# EAGLE design esp_ble (EAGLE 7.1.0)
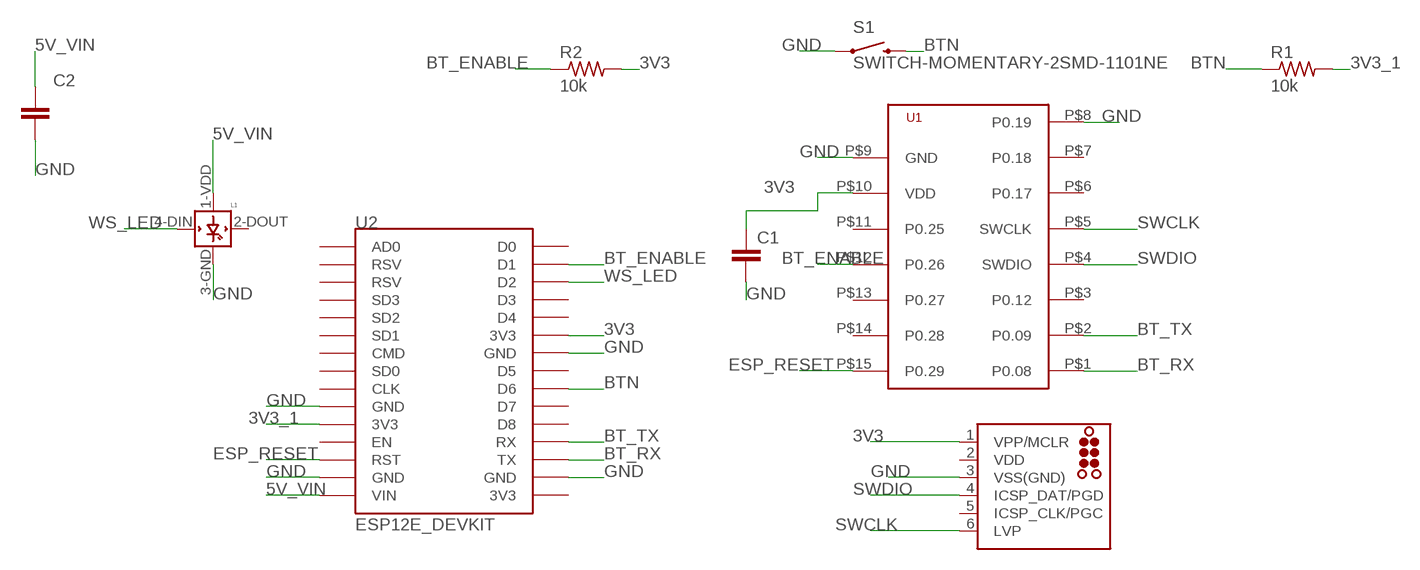
[diagram p0: schematic, sheet 1]

## Parts
C1  CAP0603-CAP  [0603-CAP]
C2  CAPACITOR_NPOL-0603  [C603]
J1  TC2030-MCP-NL  [TC2030-MCP-NL]
L1  WS2812B  [WS2812B]
R1  10k  RESISTOR0603  [R0603]
R2  10k  RESISTOR0603  [R0603]
S1  SWITCH-MOMENTARY-2SMD-1101NE  [TACTILE-SWITCH-1101NE]
U1  PTR5518  [PTR5518]
U2  ESP12E_DEVKIT  [ESP12E_DEVKIT]

## Nets
3V3: C1.1 J1.1(VPP/MCLR) R2.2 U1.P$10(VDD) U2.3V3@1(3V3)
3V3_1: R1.2 U2.3V3@0(3V3)
5V_VIN: C2.1 L1.1-VDD(VDD) U2.VIN
BT_ENABLE: R2.1 U1.P$12(P0.26) U2.D1
BT_RX: U1.P$1(P0.08) U2.TX
BT_TX: U1.P$2(P0.09) U2.RX
BTN: R1.1 S1.2 U2.D6
ESP_RESET: U1.P$15(P0.29) U2.RST
GND: C1.2 C2.2 J1.3(VSS(GND)) L1.3-GND(GND) S1.1 U1.P$8(P0.19) U1.P$9(GND) U2.GND@0(GND) U2.GND@1(GND) U2.GND@2(GND) U2.GND@3(GND)
SWCLK: J1.6(LVP) U1.P$5(SWCLK)
SWDIO: J1.4(ICSP_DAT/PGD) U1.P$4(SWDIO)
WS_LED: L1.4-DIN(DIN) U2.D2
Unconnected: J1.5(ICSP_CLK/PGC) L1.2-DOUT(DOUT) U1.P$3(P0.12) U1.P$6(P0.17) U1.P$7(P0.18) U1.P$11(P0.25) U1.P$13(P0.27) U1.P$14(P0.28) U2.3V3@2(3V3) U2.AD0 U2.CLK U2.CMD U2.D0 U2.D3 U2.D4 U2.D5 U2.D7 U2.D8 U2.EN U2.RSV@0(RSV) U2.RSV@1(RSV) U2.SD0 U2.SD1 U2.SD2 U2.SD3

## Power pins joined to a net without a drawn wire
VDD: J1.2(VDD)

## Library data of the parts
C1 = SparkFun:CAP: Capacitor Standard 0603 ceramic capacitor, and 0.1" leaded capacitor.
C2 = dp_devices:CAPACITOR_NPOL: Non-Polarized capacitor in various packages
J1 = tag-connect:TC2030: TAG-CONNECT ICSP Connector Manufacturer: Tag-Connect <http://www.tag-connect.com> Cable for easy In-Circuit Serial Programming. Designed for Microchip ICD2, suitable for many others. Two variants - one "with legs" (for hands-free fit on PCB) and another "without legs" for quick programming. PAD Description 1 MCLR/Vpp 2 Vdd 3 GND 4 PGD (ISPDAT) 5 PGC (ISPCLK) 6 nc (used for LVP) ©2009 ROFA.cz - modified and updated by Robert Darlington ‹rdarlington@gmail.com›
L1 = adafruit:WS2812B
R1 R2 = CEDT:RESISTOR
S1 = SparkFun-Electromechanical:SWITCH-MOMENTARY-2: Various NO switches- pushbuttons, reed, etc; PROD_ID: SWCH-00815
U1 = lio:PTR5518
U2 = ESP12E_DEVKIT:ESP12E_DEVKIT: ESP12E DEVKIT BOARD

## Board
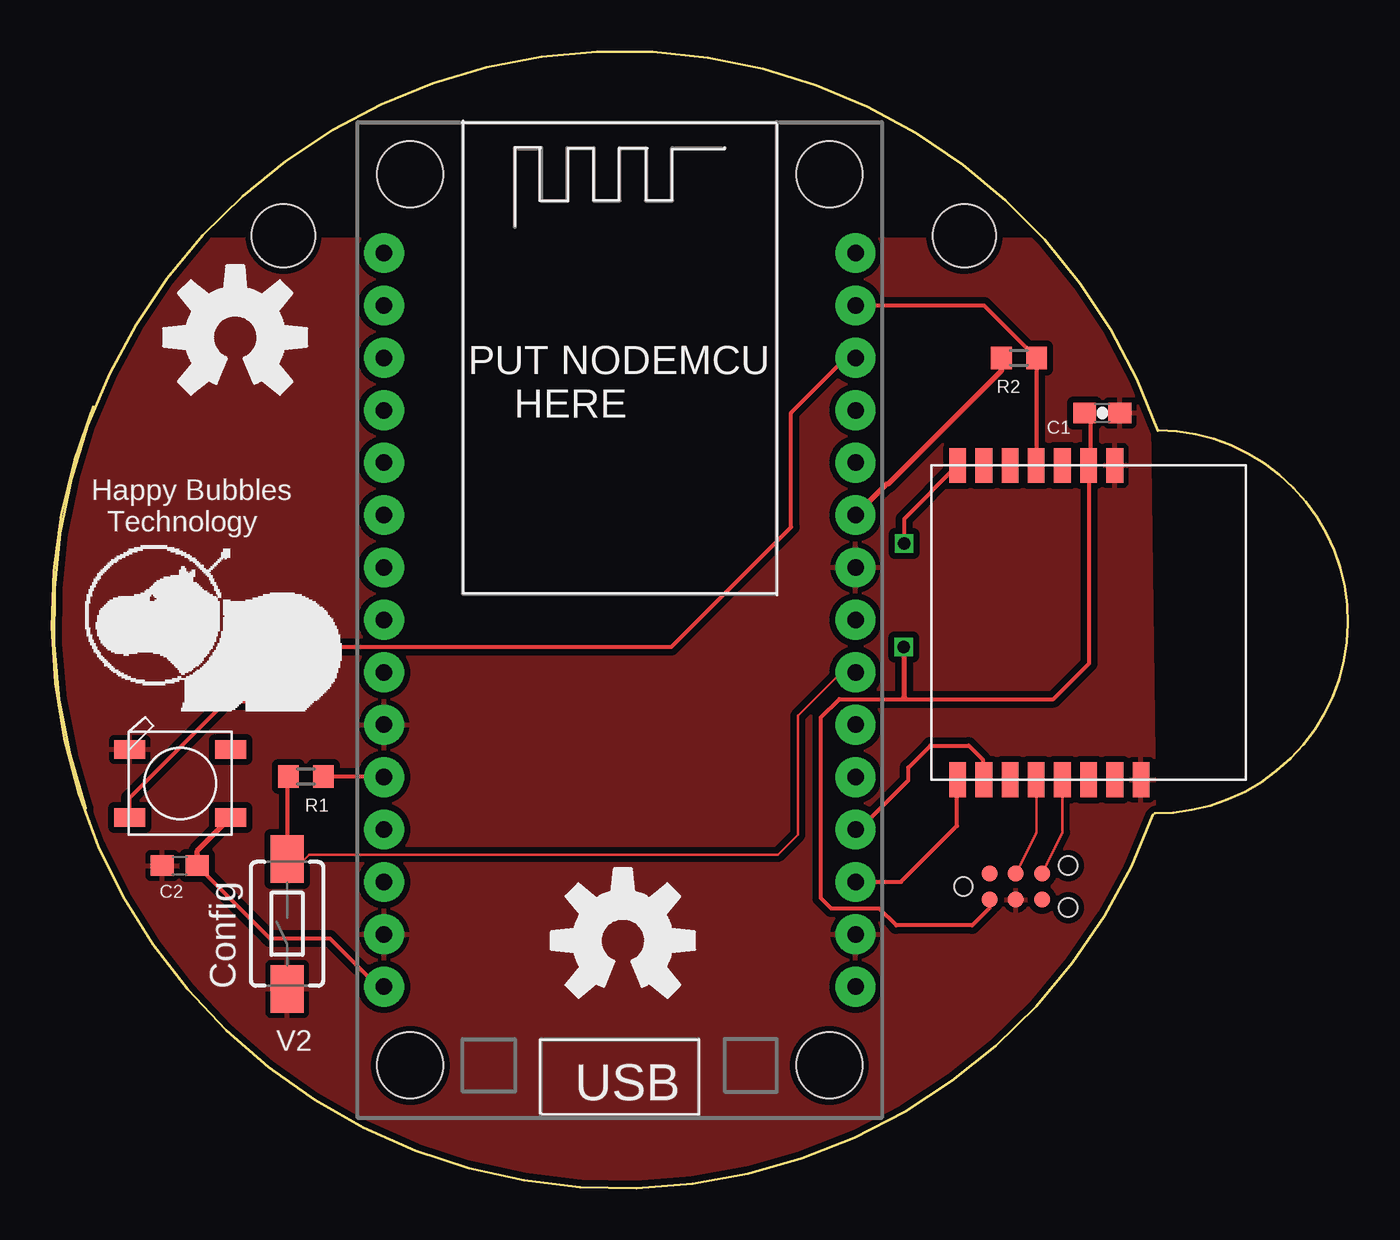
[diagram p1: board, top side]
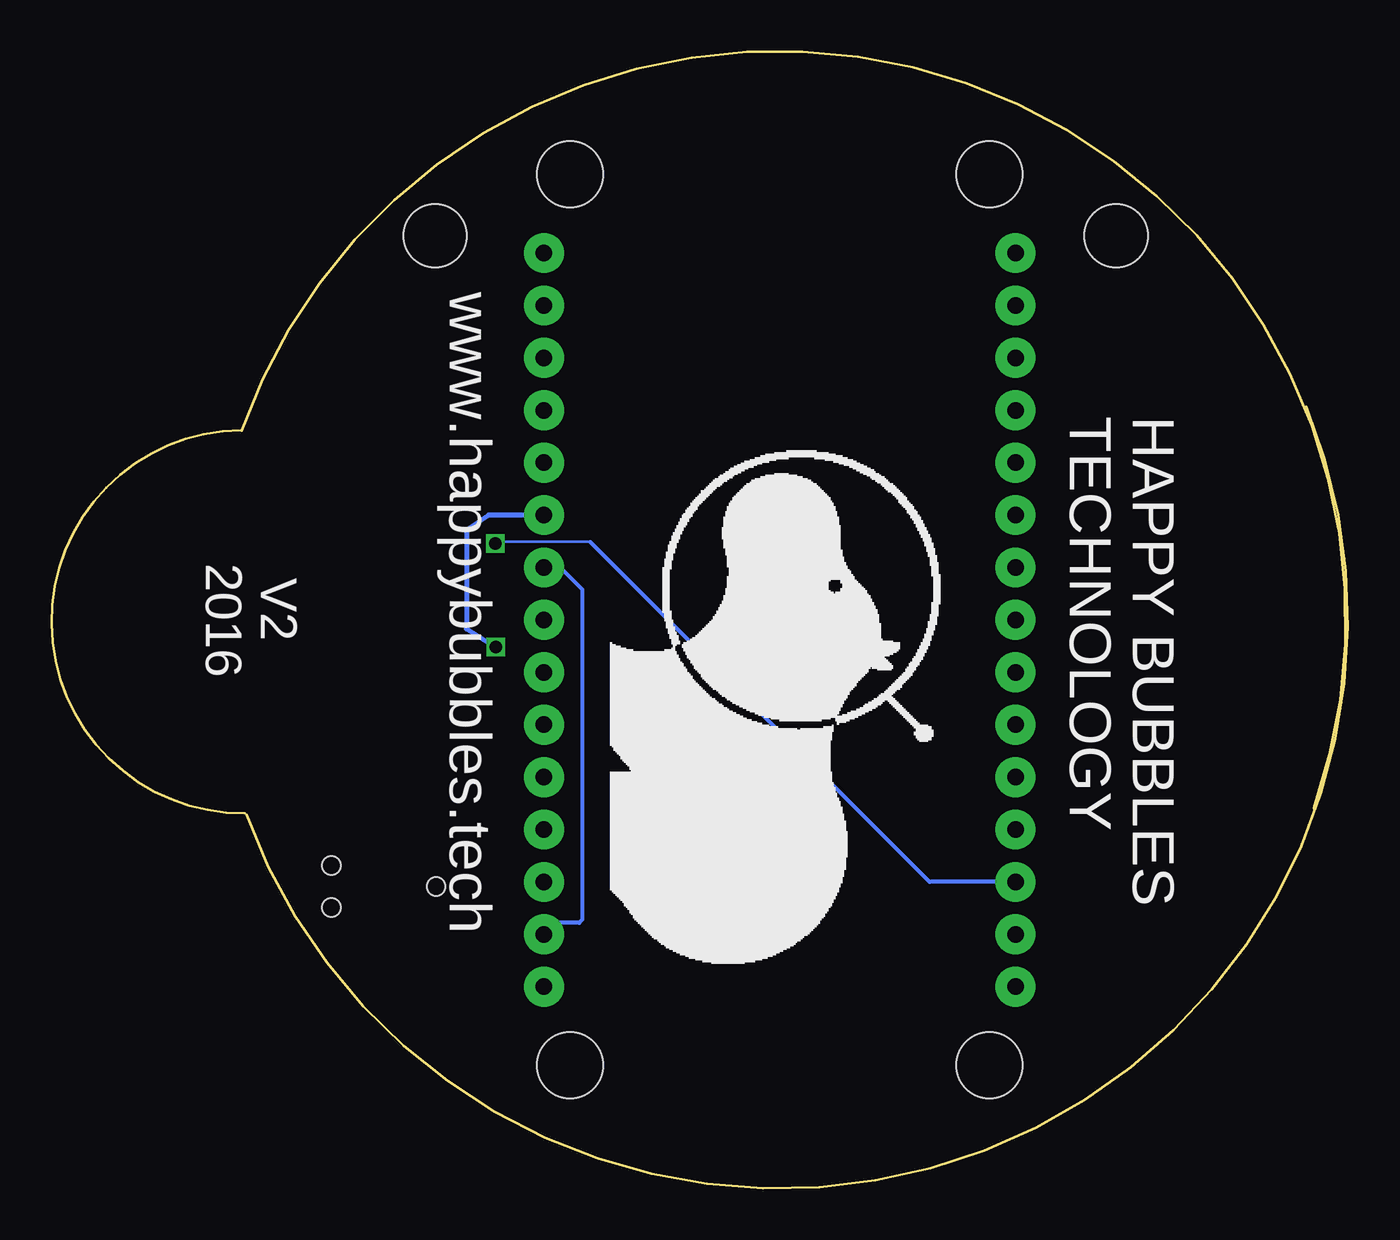
[diagram p2: board, bottom side, seen from below]

Size 62.86 x 55.09 mm. Coordinates in mm from the lower left corner, seen from the top.
Outline: 53.66,36.74 arc-180 53.48,18.17
Outline: 53.64,36.72 arc180 1.67,18.43
Outline: 53.41,18.1 arc-182 2.02,37.89
Copper layers (1*16): Top 0.035mm / dielectric 1.5mm / Bottom 0.035mm
Design rules "dirt_cheap_dirty_boards.v1": minimum track width 5mil, minimum drill 12mil, track to track 5mil, track to pad 5mil, pad to pad 5mil, via to via 5mil, smd to smd 0mil, copper to edge 10mil, drill to drill 10mil, minimum pad ring 10mil, minimum via ring 6mil, stop-mask expansion 2mil, vias tented up to drill 25mil, thermal gap 10mil
Holes 3.06 mm at 11.24,46.17 44.26,46.17

### Footprints (pad centres in the part's own frame; a part is rotated, then mirrored left to right if it is on the bottom)
0603-CAP = smd 1.1 x 1: 1 -0.85,0; 2 0.85,0
C603 = smd 1.1 x 1: 1 -0.85,0; 2 0.85,0
TC2030-MCP-NL = smd 0.787 x 0.787: 1 1.27,-0.635; 2 1.27,0.635; 3 2.54,-0.635; 4 2.54,0.635; 5 3.81,-0.635; 6 3.81,0.635 | hole 0.889: 0,0; 5.08,-1.016; 5.08,1.016
WS2812B = smd 1.5 x 0.9: 1-VDD 2.45,-1.65; 2-DOUT 2.45,1.65; 3-GND -2.45,1.65; 4-DIN -2.45,-1.65
R0603 = smd 1 x 1.1: 1 -0.85,0; 2 0.85,0
TACTILE-SWITCH-1101NE = smd 2.3 x 1.6: 1 -3.15,0; 2 3.15,0
PTR5518 = smd 1.676 x 0.813: P$1 7.62,-6.35; P$2 7.62,-5.08; P$3 7.62,-3.81; P$4 7.62,-2.54; P$5 7.62,-1.27; P$6 7.62,0; P$7 7.62,1.27; P$8 7.62,2.54; P$9 -7.62,1.27; P$10 -7.62,0; P$11 -7.62,-1.27; P$12 -7.62,-2.54; P$13 -7.62,-3.81; P$14 -7.62,-5.08; P$15 -7.62,-6.35
ESP12E_DEVKIT = drill 0.8 pad 1.93: 3V3@0 -11.43,-7.62; 3V3@1 11.43,5.08; 3V3@2 11.43,-17.78; AD0 -11.43,17.78; CLK -11.43,-2.54; CMD -11.43,2.54; D0 11.43,17.78; D1 11.43,15.24; D2 11.43,12.7; D3 11.43,10.16; D4 11.43,7.62; D5 11.43,0; D6 11.43,-2.54; D7 11.43,-5.08; D8 11.43,-7.62; EN -11.43,-10.16; GND@0 -11.43,-5.08; GND@1 -11.43,-15.24; GND@2 11.43,2.54; GND@3 11.43,-15.24; RST -11.43,-12.7; RSV@0 -11.43,15.24; RSV@1 -11.43,12.7; RX 11.43,-10.16; SD0 -11.43,0; SD1 -11.43,5.08; SD2 -11.43,7.62; SD3 -11.43,10.16; TX 11.43,-12.7; VIN -11.43,-17.78 | hole 3.2: -10.16,21.59; 10.16,21.59; 10.16,-21.59; -10.16,-21.59

### Placement (x,y rotation side)
C1  50.94,37.58 0 top
C2  6.21,15.64 180 top
J1  44.21,14.62 0 top
L1  6.24,19.62 0 top
R1  12.33,19.95 0 top
R2  46.9,40.25 180 top
S1  11.42,12.82 90 top
U1  50.28,27.42 270 top
U2  27.55,27.55 0 top
U$1  [HAPPY_HIPPO_500MIL]  1.67,23.15 0 top
U$4  [OSHW-LOGO-L]  8.91,41.24 0 top
U$5  [HAPPY_HIPPO]  35.73,35.73 270 bottom
U$6  [OSHW-LOGO-L]  27.7,12 0 top

### Tracks (layer width: path | path; a pad name or v marks a point on that pad's centre or on a via)
3V3  (via drill 0.6)
  Top 0.203: J1.1 45.48,13.58 44.64,12.74 40.96,12.74 40.15,13.55 37.81,13.55 37.3,14.06 37.3,22.82 38.19,23.71 41.42,23.71 48.58,23.71 50.31,25.44 50.31,35.02 U1.P$10 50.36,35.12 50.36,37.31 C1.1
  Top 0.254: v41.32,26.23 41.32,23.81 41.42,23.71 | R2.2 46.05,39.63 40.55,34.13 40.48,34.13 U2.3V3@1
  Bottom 0.254: U2.3V3@1 41.67,32.63 42.74,31.89 42.74,27.12 v41.32,26.23
3V3_1
  Top 0.127: U2.3V3@0 16.09,19.95
  Top 0.203: 16.09,19.95 R1.2
5V_VIN
  Top 0.203: 7.06,16.17 C2.1 10.59,12.1 13.5,12.1 15.84,9.77 U2.VIN
  Top 0.254: 7.06,16.17 7.06,16.35 L1.1-VDD
BT_ENABLE
  Top 0.203: U2.D1 45.21,42.79 R2.1 47.75,35.05 U1.P$12
BT_RX
  Top 0.203: U2.TX 41.19,14.85 43.91,17.57 43.91,19.78 U1.P$1
BT_TX
  Top 0.203: U2.RX 39.16,17.39 41.54,19.78 41.54,20.38 42.61,21.45 44.47,21.45 45.15,20.77 45.15,19.85 U1.P$2
BTN
  Top 0.127: S1.2 11.32,15.97 11.01,15.66 11.98,15.66 12.49,16.17 35.22,16.17 36.19,17.13 36.19,22.9 38.29,25.01 U2.D6 | R1.1 11.42,19.89
  Top 0.203: 11.42,19.89 S1.2
ESP_RESET  (via drill 0.6)
  Top 0.203: v41.34,31.26 41.34,32.45 U1.P$15
  Bottom 0.127: 36.74,31.33 41.29,31.33
  Bottom 0.203: U2.RST 20.29,14.85 36.74,31.33 | 41.29,31.33 v41.34,31.26
GND
  Bottom 0.203: U2.GND@2 38.19,30.09 37.13,29.02 37.13,13.02 37.28,12.87 38.42,12.87 U2.GND@3
  pour Top (isolate 0.305): -0.01,-2.42 -0.26,-2.42 0.37,46.04 53.13,46.01 53.79,-2.27
SWCLK
  Top 0.127: J1.6 49.01,17.24 U1.P$5
SWDIO
  Top 0.127: J1.4 47.74,17.24 U1.P$4
WS_LED
  Top 0.203: 38.52,40.25 35.86,37.58 35.86,32.04 30.04,26.23 12.03,26.23 9.41,23.61 8.47,23.61 3.79,18.93 L1.4-DIN
  Top 0.254: 38.52,40.25 U2.D2

### Text on the board
tNames: PUT NODEMCU / HERE | Happy Bubbles / Technology | Config | V2 | USB
bNames: www.happybubbles.tech | HAPPY BUBBLES / TECHNOLOGY | V2 / 2016